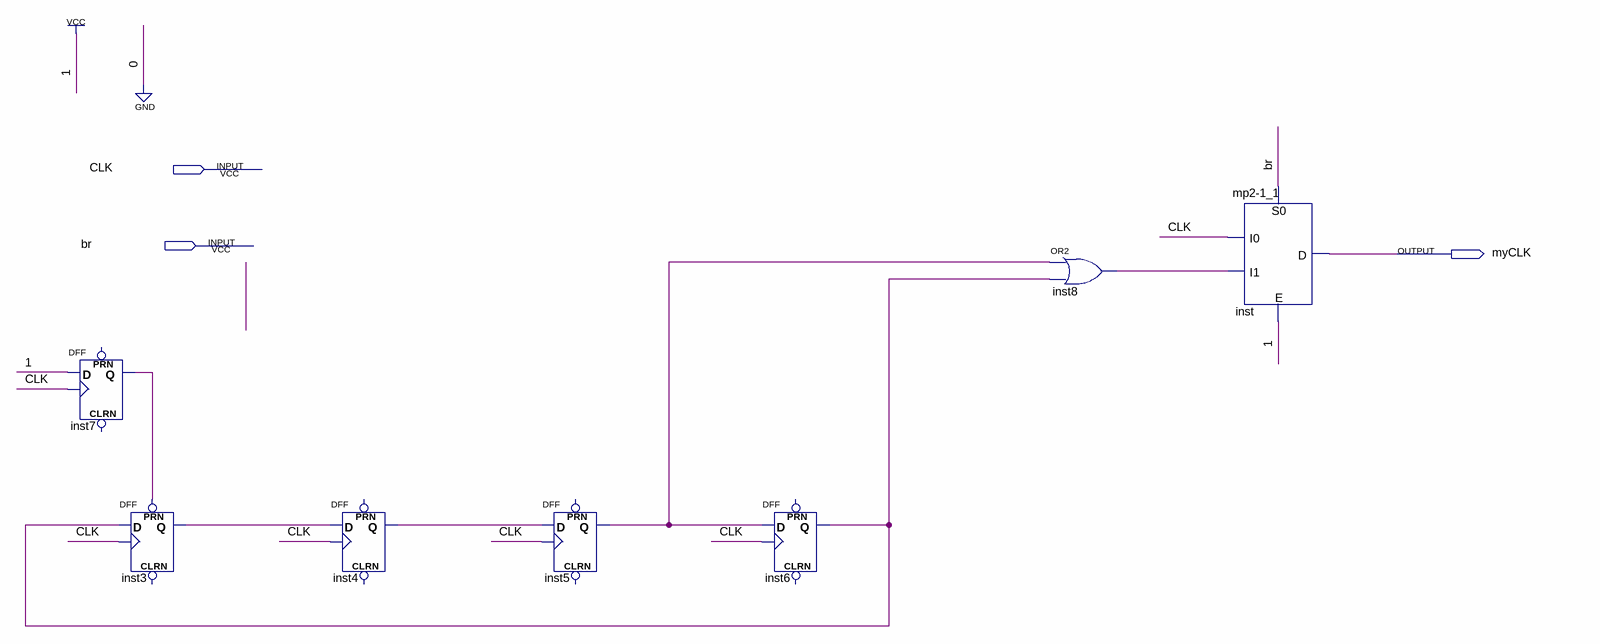
[diagram p0: schematic sheet]
// Quartus schematic myCLK.bdf as structural Verilog: 7 symbols, 3 pins
module myCLK (
  input  CLK,
  input  br,
  output myCLK
);

  wire inst3_q, inst4_q, inst5_q, inst6_q, inst7_q, inst8_out;

  DFF inst7 (.CLK(CLK), .D(1'b1), .Q(inst7_q));  // open: CLRN, PRN
  DFF inst3 (.CLK(CLK), .D(inst6_q), .PRN(inst7_q), .Q(inst3_q));  // open: CLRN
  DFF inst4 (.CLK(CLK), .D(inst3_q), .Q(inst4_q));  // open: CLRN, PRN
  DFF inst5 (.CLK(CLK), .D(inst4_q), .Q(inst5_q));  // open: CLRN, PRN
  DFF inst6 (.CLK(CLK), .D(inst5_q), .Q(inst6_q));  // open: CLRN, PRN
  or inst8 (inst8_out, inst5_q, inst6_q);
  \mp2-1_1  inst (.E(1'b1), .I0(CLK), .I1(inst8_out), .S0(br), .D(myCLK));
endmodule
